# Altium schematic sheet S06.SchDoc: IEEE-1394/Ethernet FPGA Controller
size 381 x 254 mm; Revision: 3.2; SheetNumber: 6; SheetTotal: 10
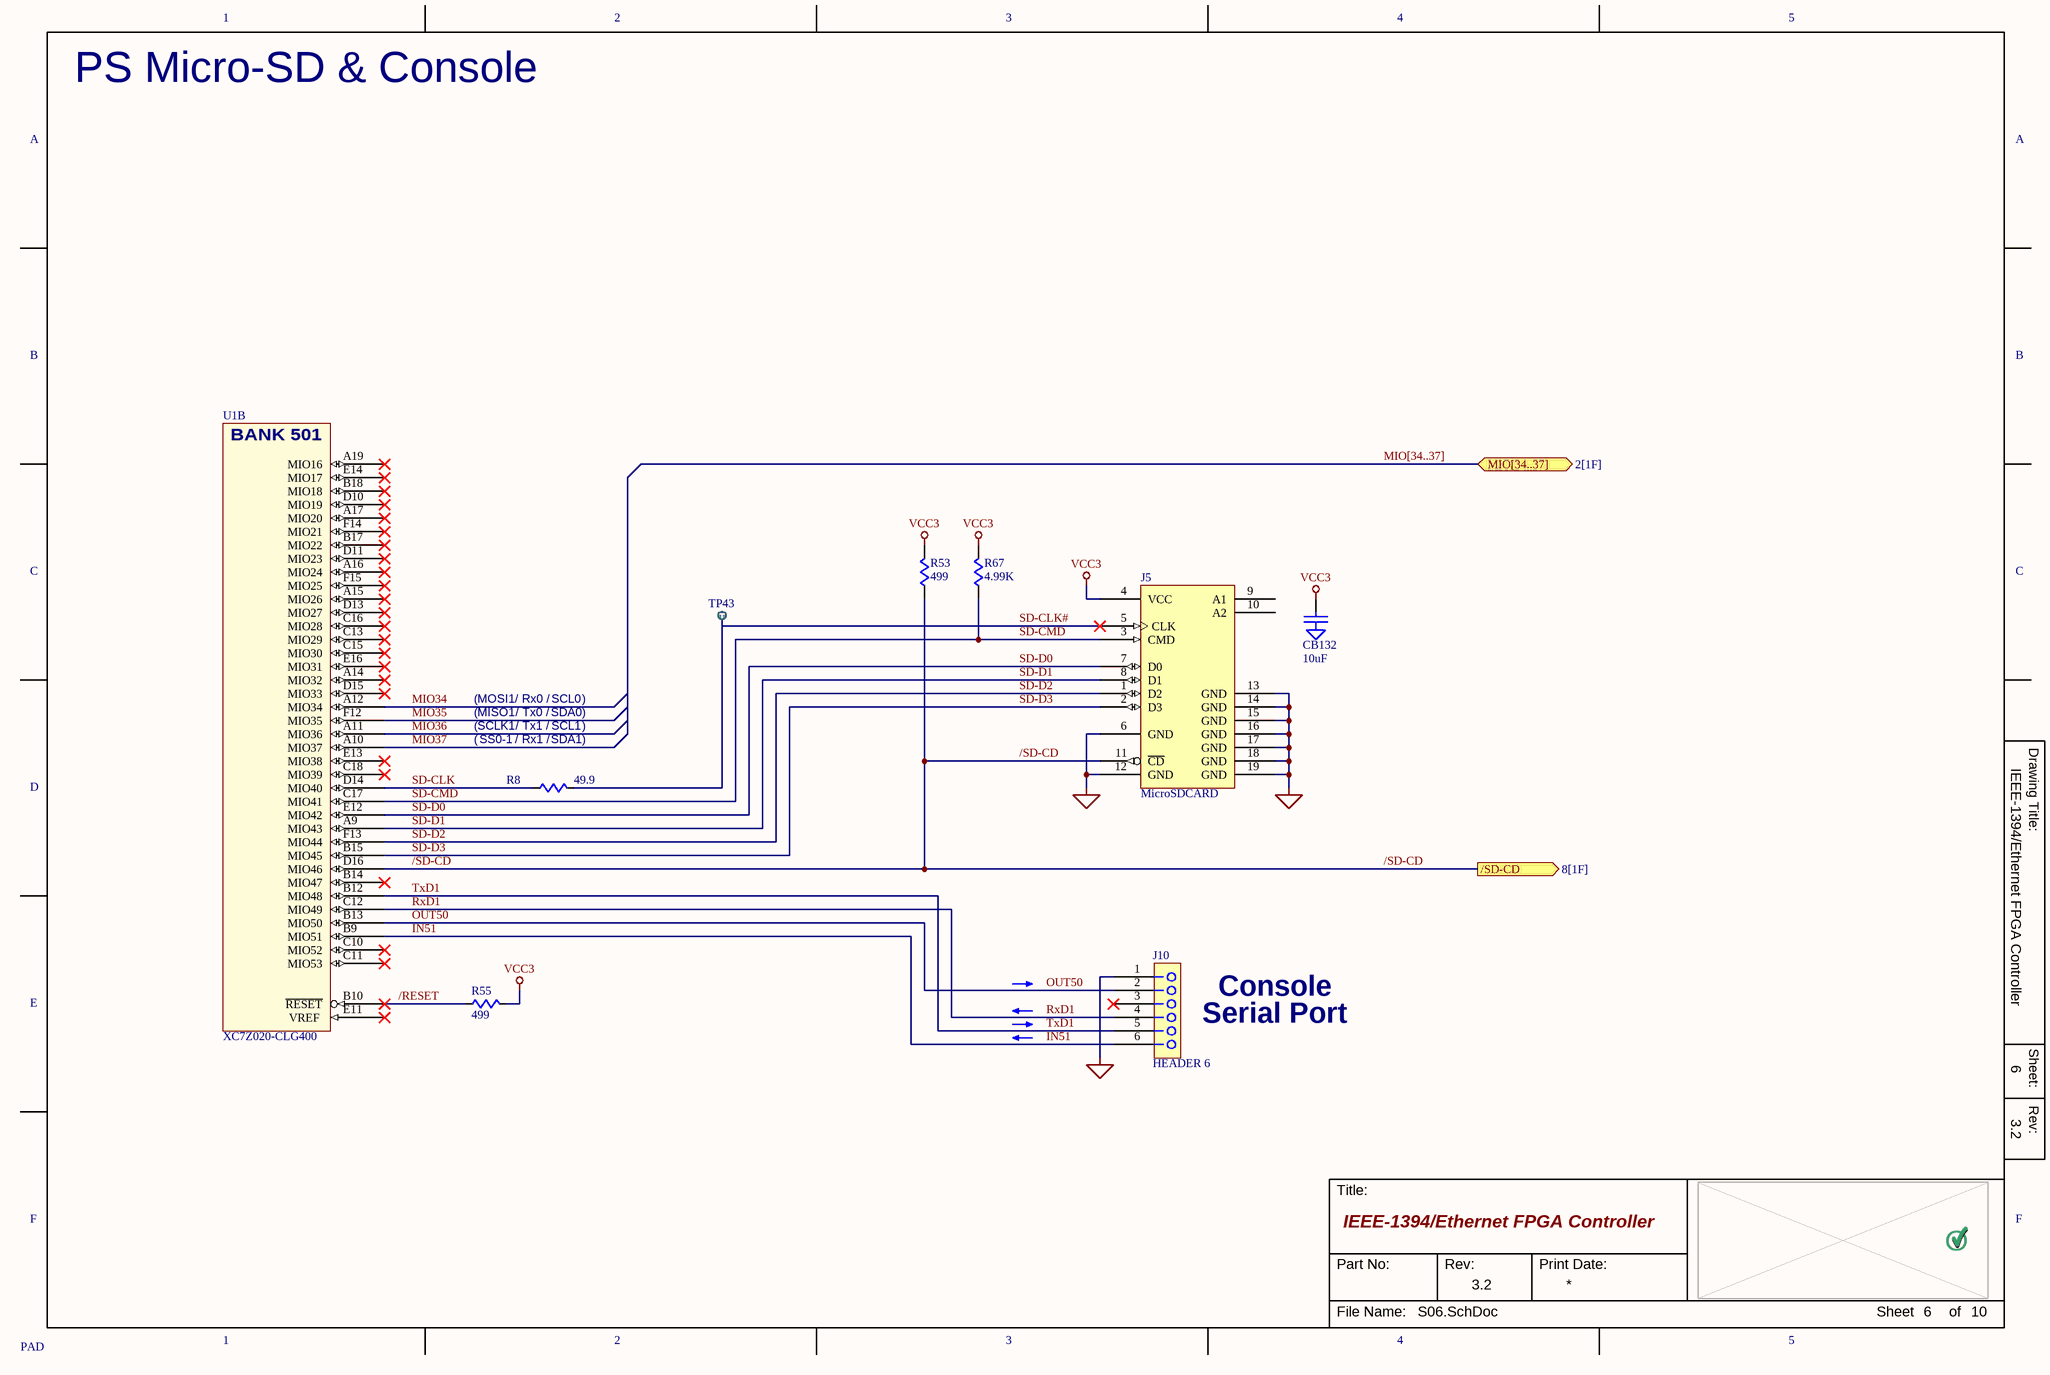
[diagram p0: S06.SchDoc]

## Parts
CB132  10uF  [CB0603]
J5  MicroSDCARD  [CONN-uSD-JAE-ST12S0]
J10  HEADER 6  [HDR-6x1-100]
R8  49.9  [R0201]
R53  499  [R0402]
R55  499  [R0402]
R67  4.99K  [R0402]
TP43  Footprint: PAD  (hidden comment: SD-CLK#)  (no BOM)
U1  XC7Z020-CLG400  [BGA-400-08mm]  (part B of 9)

## Ports
/SD-CD (out, see 8[1F]), MIO[34..37] (bidir, see 2[1F])

## Nets
GND: CB132.2(GND) J5.6(GND) J5.12(GND) J5.13(GND) J5.14(GND) J5.15(GND) J5.16(GND) J5.17(GND) J5.18(GND) J5.19(GND) J10.1
VCC3: CB132.1 J5.4(VCC) R53.2 R55.2 R67.2
/RESET: R55.1 U1.B10(~{RESET})
/SD-CD: J5.11(~{CD}) R53.1 U1.D16(MIO46) ; port /SD-CD
IN51: J10.6 U1.B9(MIO51)
MIO34: U1.A12(MIO34)
MIO35: U1.F12(MIO35)
MIO36: U1.A11(MIO36)
MIO37: U1.A10(MIO37)
OUT50: J10.2 U1.B13(MIO50)
RxD1: J10.4 U1.C12(MIO49)
SD-CLK: R8.1 U1.D14(MIO40)
SD-CLK#: J5.5(CLK) R8.2 TP43.1
SD-CMD: J5.3(CMD) R67.1 U1.C17(MIO41)
SD-D0: J5.7(D0) U1.E12(MIO42)
SD-D1: J5.8(D1) U1.A9(MIO43)
SD-D2: J5.1(D2) U1.F13(MIO44)
SD-D3: J5.2(D3) U1.B15(MIO45)
TxD1: J10.5 U1.B12(MIO48)

Not connected (* = marked no-connect by the designer): J5 9(A1) 10(A2); J10 3*; U1 A14(MIO32)* A15(MIO26)* A16(MIO24)* A17(MIO20)* A19(MIO16)* B14(MIO47)* B17(MIO22)* B18(MIO18)* C10(MIO52)* C11(MIO53)* C13(MIO29)* C15(MIO30)* C16(MIO28)* C18(MIO39)* D10(MIO19)* D11(MIO23)* D13(MIO27)* D15(MIO33)* E11(VREF_)* E13(MIO38)* E14(MIO17)* E16(MIO31)* F14(MIO21)* F15(MIO25)*

## Buses and harness runs
bus MIO[34..37] = port MIO[34..37]

## Notes on the sheet
- PS Micro-SD & Console
- (
- MOSI1
- / Rx0 /
- SCL0
- )
- MISO1
- SCLK1
- (near R8) SS0-1
- / Tx0 /
- / Tx1 /
- (near R8) / Rx1 /
- SDA0
- SCL1
- (near R8) SDA1
- (near R8) )
- Console
- (near J10) Serial Port
- 1
- 2
- 3
- 4
- 5
- A
- B
- C
- Drawing Title:
- D
- E
- Sheet:
- Rev:
- F
- Title:
- Part No:
- Print Date:
- File Name:
- Sheet
- of
- (in symbol XC7Z020-CLG400, part B) BANK 501

## Library data of the parts
CB132 = CAP-GND
J5 = CONN-MICROSD-ST12S0
R8 R53 R55 R67 = R
TP43 = Tomachie_TP_North: Test Point